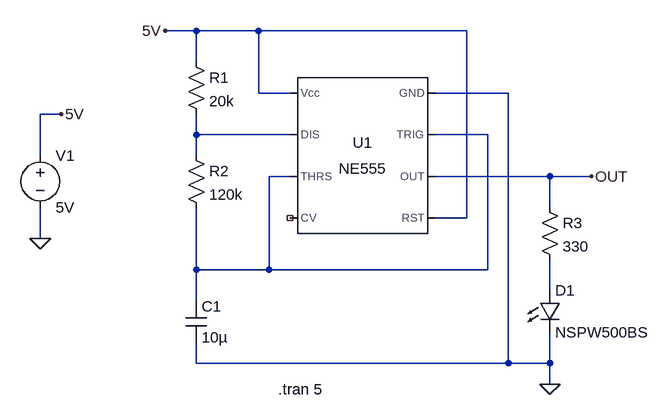
[diagram p0: schematic Blinky555.asc]
Blinky555.asc, the LTspice schematic file:
Version 4
SHEET 1 880 680
WIRE -80 -16 -128 -16
WIRE 16 -16 -80 -16
WIRE 336 -16 16 -16
WIRE -80 32 -80 -16
WIRE 16 80 16 -16
WIRE 64 80 16 80
WIRE 400 80 288 80
WIRE -288 112 -320 112
WIRE -80 144 -80 112
WIRE 64 144 -80 144
WIRE 368 144 288 144
WIRE -320 176 -320 112
WIRE -80 176 -80 144
WIRE 64 208 32 208
WIRE 464 208 288 208
WIRE 528 208 464 208
WIRE 464 256 464 208
WIRE 336 272 336 -16
WIRE 336 272 288 272
WIRE -320 304 -320 256
WIRE -80 352 -80 256
WIRE 32 352 32 208
WIRE 32 352 -80 352
WIRE 368 352 368 144
WIRE 368 352 32 352
WIRE 464 384 464 336
WIRE -80 400 -80 352
WIRE -80 496 -80 464
WIRE 400 496 400 80
WIRE 400 496 -80 496
WIRE 464 496 464 448
WIRE 464 496 400 496
WIRE 464 528 464 496
FLAG 464 528 0
FLAG -320 304 0
FLAG -288 112 5V
FLAG 528 208 OUT
FLAG -128 -16 5V
SYMBOL Misc\\NE555 176 176 M0
SYMATTR InstName U1
SYMBOL voltage -320 160 R0
WINDOW 123 0 0 Left 2
WINDOW 39 0 0 Left 2
SYMATTR InstName V1
SYMATTR Value 5V
SYMBOL res -96 16 R0
SYMATTR InstName R1
SYMATTR Value 20k
SYMBOL res -96 160 R0
SYMATTR InstName R2
SYMATTR Value 120k
SYMBOL cap -96 400 R0
SYMATTR InstName C1
SYMATTR Value 10µ
SYMBOL res 448 240 R0
SYMATTR InstName R3
SYMATTR Value 330
SYMBOL LED 448 384 R0
SYMATTR InstName D1
SYMATTR Value NSPW500BS
SYMATTR Description Diode
SYMATTR Type diode
TEXT 46 536 Left 2 !.tran 5

The netlist it stands for:
* Blinky555.asc
XU1 0 N002 OUT 5V NC_01 N002 N001 5V NE555  ; pins GND TRIG OUT RST CV THRS DIS Vcc
V1 5V 0 5V
R1 5V N001 20k
R2 N001 N002 120k
C1 N002 0 10µ
R3 OUT N003 330
D1 N003 0 NSPW500BS
.model D D
.lib standard.dio
.tran 5
.lib NE555.sub
.backanno
.end